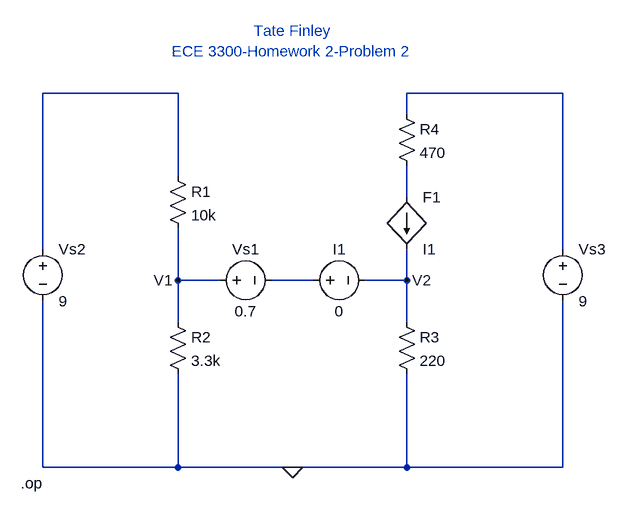
[diagram p0: schematic ECE3300_Fall2023_HW2_Problem2.asc]
ECE3300_Fall2023_HW2_Problem2.asc, the LTspice schematic file:
Version 4
SHEET 1 880 680
WIRE 64 -128 -144 -128
WIRE 656 -128 416 -128
WIRE 416 -96 416 -128
WIRE 64 0 64 -128
WIRE 416 32 416 -16
WIRE -144 112 -144 -128
WIRE 656 112 656 -128
WIRE 64 160 64 80
WIRE 128 160 64 160
WIRE 272 160 208 160
WIRE 416 160 416 112
WIRE 416 160 352 160
WIRE 64 224 64 160
WIRE 416 224 416 160
WIRE -144 448 -144 192
WIRE 64 448 64 304
WIRE 64 448 -144 448
WIRE 240 448 64 448
WIRE 416 448 416 304
WIRE 416 448 240 448
WIRE 656 448 656 192
WIRE 656 448 416 448
FLAG 240 448 0
FLAG 64 160 V1
FLAG 416 160 V2
SYMBOL voltage 112 160 R270
WINDOW 0 32 56 VTop 2
WINDOW 3 -32 56 VBottom 2
WINDOW 123 0 0 Left 0
WINDOW 39 0 0 Left 0
SYMATTR InstName Vs1
SYMATTR Value 0.7
SYMBOL res 48 -16 R0
SYMATTR InstName R1
SYMATTR Value 10k
SYMBOL res 48 208 R0
SYMATTR InstName R2
SYMATTR Value 3.3k
SYMBOL res 400 208 R0
SYMATTR InstName R3
SYMATTR Value 220
SYMBOL res 400 -112 R0
SYMATTR InstName R4
SYMATTR Value 470
SYMBOL f 416 32 R0
SYMATTR InstName F1
SYMATTR Value I1
SYMATTR Value2 20
SYMBOL voltage 256 160 R270
WINDOW 0 32 56 VTop 2
WINDOW 3 -32 56 VBottom 2
WINDOW 123 0 0 Left 0
WINDOW 39 0 0 Left 0
SYMATTR InstName I1
SYMATTR Value 0
SYMBOL voltage -144 96 R0
WINDOW 123 0 0 Left 0
WINDOW 39 0 0 Left 0
SYMATTR InstName Vs2
SYMATTR Value 9
SYMBOL voltage 656 96 R0
WINDOW 123 0 0 Left 0
WINDOW 39 0 0 Left 0
SYMATTR InstName Vs3
SYMATTR Value 9
TEXT -178 472 Left 2 !.op
TEXT 240 -208 Center 2 ;Tate Finley\nECE 3300-Homework 2-Problem 2

The netlist it stands for:
* ECE3300_Fall2023_HW2_Problem2.asc
Vs1 V1 N004 0.7
R1 N001 V1 10k
R2 V1 0 3.3k
R3 V2 0 220
R4 N002 N003 470
F1 N003 V2 I1 20
V§I1 N004 V2 0
Vs2 N001 0 9
Vs3 N002 0 9
.op
* Tate Finley
* ECE 3300-Homework 2-Problem 2
.backanno
.end